# Altium schematic sheet 1_interface.schdoc: Solar Cells
size A4; Engineer: Eng_2_ALT; SheetNumber: 2; SheetTotal: 3; Designed by: André M. P. Mattos; Version: v0.1
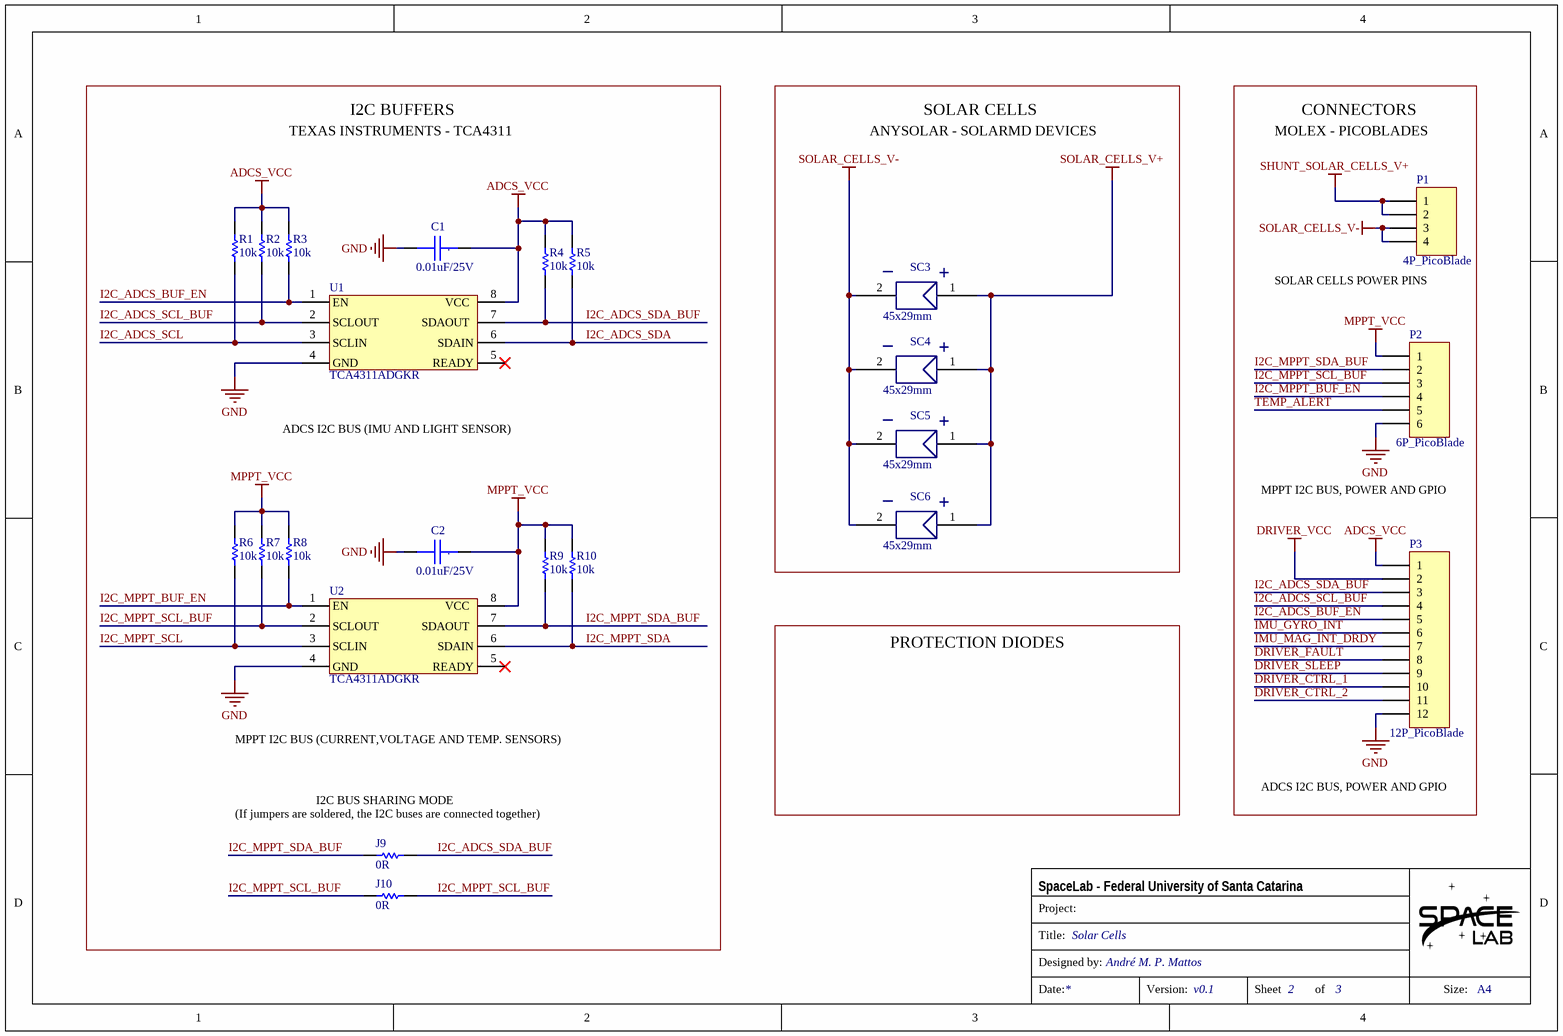
[diagram p0: 1_interface.schdoc]

## Parts
C1  0.01uF/25V  [CC0805]
C2  0.01uF/25V  [CC0805]
J9  0R  [0805]
J10  0R  [0805]
P1  4P_PicoBlade  [HDR4 PicoBlade]
P2  6P_PicoBlade  [HDR6 PicoBlade]
P3  12P_PicoBlade  [HDR12 PicoBlade - duplicate]
R1  10k  [0805]
R2  10k  [0805]
R3  10k  [0805]
R4  10k  [0805]
R5  10k  [0805]
R6  10k  [0805]
R7  10k  [0805]
R8  10k  [0805]
R9  10k  [0805]
R10  10k  [0805]
SC3  size: 45x29mm  [45x29mm_cell]  (hidden comment: SC)
SC4  size: 45x29mm  [45x29mm_cell]  (hidden comment: SC)
SC5  size: 45x29mm  [45x29mm_cell]  (hidden comment: SC)
SC6  size: 45x29mm  [45x29mm_cell]  (hidden comment: SC)
U1  TCA4311ADGKR  [DGK8]
U2  TCA4311ADGKR  [DGK8]

## Blocks framed on the sheet
I2C BUFFERS: C1 C2 J9 J10 R1-R10 U1 U2
SOLAR CELLS: SC3-SC6
CONNECTORS: P1-P3

## Nets
ADCS_VCC: C1.1 P3.1 R1.2 R2.2 R3.2 R4.2 R5.2 U1.8(VCC)
DRIVER_VCC: P3.2
GND: C1.2 C2.2 P2.6 P3.12 U1.4(GND) U2.4(GND)
MPPT_VCC: C2.1 P2.1 R6.2 R7.2 R8.2 R9.2 R10.2 U2.8(VCC)
SHUNT_SOLAR_CELLS_V+: P1.1 P1.2
SOLAR_CELLS_V+: SC3.1(V+) SC4.1(V+) SC5.1(V+) SC6.1(V+)
SOLAR_CELLS_V-: P1.3 P1.4 SC3.2(V-) SC4.2(V-) SC5.2(V-) SC6.2(V-)
DRIVER_CTRL_1: P3.10
DRIVER_CTRL_2: P3.11
DRIVER_FAULT: P3.8
DRIVER_SLEEP: P3.9
I2C_ADCS_BUF_EN: P3.5 R3.1 U1.1(EN)
I2C_ADCS_SCL: R1.1 U1.3(SCLIN)
I2C_ADCS_SCL_BUF: P3.4 R2.1 U1.2(SCLOUT)
I2C_ADCS_SDA: R5.1 U1.6(SDAIN)
I2C_ADCS_SDA_BUF: J9.1 P3.3 R4.1 U1.7(SDAOUT)
I2C_MPPT_BUF_EN: P2.4 R8.1 U2.1(EN)
I2C_MPPT_SCL: R6.1 U2.3(SCLIN)
I2C_MPPT_SCL_BUF: J10.1 J10.2 P2.3 R7.1 U2.2(SCLOUT)
I2C_MPPT_SDA: R10.1 U2.6(SDAIN)
I2C_MPPT_SDA_BUF: J9.2 P2.2 R9.1 U2.7(SDAOUT)
IMU_GYRO_INT: P3.6
IMU_MAG_INT_DRDY: P3.7
TEMP_ALERT: P2.5

Not connected (* = marked no-connect by the designer): U1 5(READY)*; U2 5(READY)*

## Notes on the sheet
- TEXAS INSTRUMENTS - TCA4311
- ANYSOLAR - SOLARMD DEVICES
- MOLEX - PICOBLADES
- (near P1) SOLAR CELLS POWER PINS
- ADCS I2C BUS (IMU AND LIGHT SENSOR)
- MPPT I2C BUS, POWER AND GPIO
- PROTECTION DIODES
- MPPT I2C BUS (CURRENT,VOLTAGE AND TEMP. SENSORS)
- ADCS I2C BUS, POWER AND GPIO
- (near J9) (If jumpers are soldered, the I2C buses are connected together)
- (near J9) I2C BUS SHARING MODE
- Project:
- SpaceLab - Federal University of Santa Catarina
- Title:
- Designed by:
- Date:
- Version:
- Sheet
- of
- Size:
- A4
- (in symbol Cap_Cer_X7R_0.01uF_50V_0805) .
- (in symbol solar_cell_sm141k08lv) _; +

## Library data of the parts
C1 C2 = Cap_Cer_X7R_0.01uF_50V_0805: CAP CER 0.01uF 25V 10% X7R 0805; Partnumber: CL21B103KAANNNC; NCM: 8532.24.10
J9 J10 = R0R_JUMPER_1/16W_0805: RES 0R OHM 1/16W JUMPER 0805; Partnumber: CRCW08050000Z0EA; NCM: 8533.21.20
P1 = Header 4_PicoBlade: Header, 4-Pin; PartNumber: 53398-0471; Manufacturer: Molex; Body Plating: Tin; Number of Positions: 4; Gender: Male; Current Rating: 1A; Voltage Rating: 125V; Contact Resistance: 20mR; Insulation Resistance: 100MR; Pitch: 1.25mm; Glow Wire Compliant: Non-compliant; LatestRevisionDate: 17-Jul-2002; LatestRevisionNote: Re-released for DXP Platform.; Publisher: Altium Limited; Supplier 1: Mouser; Supplier Part Number 1: 538-53398-0471; Stock 1: 43251; Pricing 1: 1=0.98, 10=0.832, 100=0.716, 500=0.6, 1000=0.391, 2000=0.342 (USD); Mount: Surface Mount; Contact Plating: Tin; Contact Material: Bronze,Tin,Brass; Color: Natural; Housing Material: Nylon; Housing Color: Natural; Min Operating Temperature: -40°C; Max Operating Temperature: 85°C; Termination: Solder; Number of Rows: 1; Packaging: Tape and Reel; Number of Contacts: 4; Orientation: Vertical; Package Quantity: 1000; Number of Circuits: 4; Voltage Rating (AC): 125V; Working Voltage: 125V; Voltage Rating (DC): 125V; Lead Pitch: 1.25mm; Radiation Hardening: No; REACH SVHC: Unknown; Lead Free: Lead Free; Flammability Rating: UL94 V-0; ComponentLink1URL: http://www.mouser.com/ds/2/276/0533980471_PCB_HEADERS-171069.pdf?src-supplier=Mouser; ComponentLink1Description: http://www.mouser.com/ds/2/276/0533980471_PCB_HEADERS-171069.pdf?src-supplier=Mouser; ComponentLink2URL: http://www.jameco.com/Jameco/Products/ProdDS/1932627.pdf?src-supplier=Jameco; ComponentLink2Description: http://www.jameco.com/Jameco/Products/ProdDS/1932627.pdf?src-supplier=Jameco; ComponentLink3URL: https://www.distrelec.biz/Web/Downloads/46/_e/gf116833-116846_e.pdf?mime=application%2Fpdf&src-supplier=Distrelec; ComponentLink3Description: https://www.distrelec.biz/Web/Downloads/46/_e/gf116833-116846_e.pdf?mime=application%2Fpdf&src-supplier=Distrelec; ComponentLink4URL: http://www.molex.com/webdocs/datasheets/pdf/en-us/0533980471_PCB_HEADERS.pdf?src-supplier=Element14; ComponentLink4Description: http://www.molex.com/webdocs/datasheets/pdf/en-us/0533980471_PCB_HEADERS.pdf?src-supplier=Element14; ComponentLink5URL: http://www.farnell.com/datasheets/1867381.pdf?src-supplier=Element14; ComponentLink5Description: http://www.farnell.com/datasheets/1867381.pdf?src-supplier=Element14; ComponentLink6URL: http://uk.rs-online.com/webdocs/13c4/0900766b813c4500.pdf?src-supplier=RSComponents; ComponentLink6Description: http://uk.rs-online.com/webdocs/13c4/0900766b813c4500.pdf?src-supplier=RSComponents; ComponentLink7URL: http://www.molex.com/webdocs/datasheets/pdf/en-us/0533980471_PCB_HEADERS.pdf?src-supplier=Farnell; ComponentLink7Description: http://www.molex.com/webdocs/datasheets/pdf/en-us/0533980471_PCB_HEADERS.pdf?src-supplier=Farnell; ComponentLink8URL: http://www.farnell.com/datasheets/2697809.pdf?src-supplier=Element14; ComponentLink8Description: http://www.farnell.com/datasheets/2697809.pdf?src-supplier=Element14; ComponentLink9URL: http://www.molex.com/webdocs/datasheets/pdf/en-us/0533980471_PCB_HEADERS.pdf?src-supplier=Avnet; ComponentLink9Description: http://www.molex.com/webdocs/datasheets/pdf/en-us/0533980471_PCB_HEADERS.pdf?src-supplier=Avnet; ComponentLink10URL: http://www.molex.com/webdocs/datasheets/pdf/en-us/0533980471_PCB_HEADERS.pdf?src-supplier=Avnet+Europe; ComponentLink10Description: http://www.molex.com/webdocs/datasheets/pdf/en-us/0533980471_PCB_HEADERS.pdf?src-supplier=Avnet+Europe; Supplier 2: Digi-Key; Supplier Part Number 2: WM7608CT-ND; Stock 2: 20817; Pricing 2: 1=1.19, 10=1.044, 100=0.901, 500=0.73716 (USD); Manufacturer Part Number: 53398-0471
P2 = Header 6H_PicoBlade: Header, 6-Pin, Right Angle; Partnumber: 53398-0671; LatestRevisionDate: 17-Jul-2002; LatestRevisionNote: Re-released for DXP Platform.; Publisher: Altium Limited
P3 = Header 12_PicoBlade: Header, 12-Pin; PartNumber: 53398-1271; LatestRevisionDate: 17-Jul-2002; LatestRevisionNote: Re-released for DXP Platform.; Publisher: Altium Limited
R1-R10 = R10k_1%_1/8W_0805: RES 10K OHM 1/8W 1%  0805; Partnumber: CRCW080510K0FKEA; NCM: 8533.21.20
SC3-SC6 = solar_cell_sm141k08lv: sm141k08lv; partnumber: sm141k08lv; Part Number: sm141k08lv
U1 U2 = TCA4311ADGKR: IC SIGNAL BUFFER I2C VSSOP-8; Partnumber: TCA4311ADGKR